# Altium schematic sheet TopSheet.SchDoc
size A4; Organization: UltraZohm; SheetNumber: 1; SheetTotal: 15
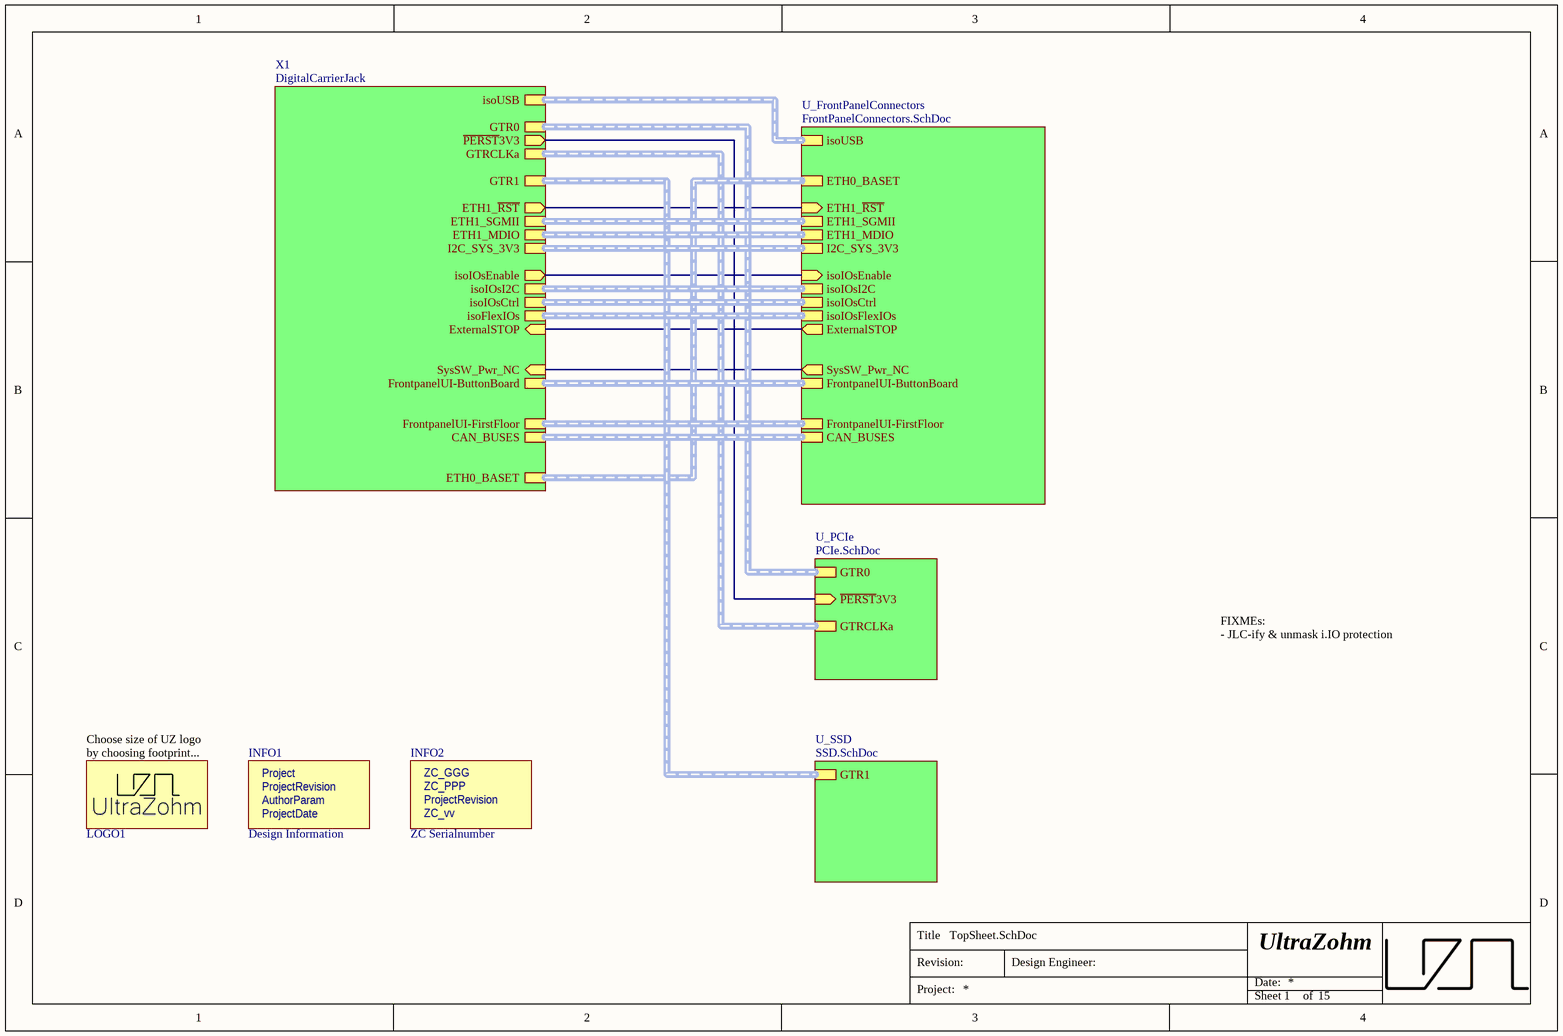
[diagram p0: TopSheet.SchDoc]

## Parts
INFO1  Design Information  [Design_info2]  (no BOM)
INFO2  ZC Serialnumber  [ZC-Serial]  (no BOM)
LOGO1  UZ Logo  [UZ_Logo_small]  (value not drawn)  (no BOM)

## Sub-sheets
U_FrontPanelConnectors = FrontPanelConnectors.SchDoc: isoUSB (harness USB), ETH0_BASET (harness ETH_BASET), ETH1_~{RST} (in), ETH1_SGMII (harness ETH_SGMII), ETH1_MDIO (harness ETH_MDIO), isoIOsEnable (in), isoIOsI2C (harness I2C), isoIOsCtrl (harness isoIOsCtrl), isoIOsFlexIOs (harness isoFlexIOs), ExternalSTOP (out), SysSW_Pwr_NC (out), FrontpanelUI-ButtonBoard (harness FrontpanelUI-ButtonBoard), FrontpanelUI-FirstFloor (harness FrontpanelUI-FirstFloor), CAN_BUSES (harness CAN_BUSES), I2C_SYS_3V3 (harness I2C)
U_PCIe = PCIe.SchDoc: GTR0 (harness GTR), ~{PERST}3V3 (in), GTRCLKa (harness MGTCLK)
U_SSD = SSD.SchDoc: GTR1 (harness GTR)
X1 = DigitalCarrierJack: isoUSB (harness USB), ETH0_BASET (harness ETH_BASET), ETH1_~{RST} (out), ETH1_SGMII (harness ETH_SGMII), ETH1_MDIO (harness ETH_MDIO), GTR0 (harness GTR), ~{PERST}3V3 (out), GTRCLKa (harness MGTCLK), GTR1 (harness GTR), isoIOsEnable (out), isoIOsI2C (harness I2C), isoIOsCtrl (harness isoIOsCtrl), isoFlexIOs (harness isoFlexIOs), ExternalSTOP (in), SysSW_Pwr_NC (in), FrontpanelUI-ButtonBoard (harness FrontpanelUI-ButtonBoard), FrontpanelUI-FirstFloor (harness FrontpanelUI-FirstFloor), CAN_BUSES (harness CAN_BUSES), I2C_SYS_3V3 (harness I2C)

## Nets
(unnamed): sheet X1/ETH1_~{RST}, sheet U_FrontPanelConnectors/ETH1_~{RST}
(unnamed): sheet X1/~{PERST}3V3, sheet U_PCIe/~{PERST}3V3
(unnamed): sheet X1/isoIOsEnable, sheet U_FrontPanelConnectors/isoIOsEnable
(unnamed): sheet X1/ExternalSTOP, sheet U_FrontPanelConnectors/ExternalSTOP
(unnamed): sheet X1/SysSW_Pwr_NC, sheet U_FrontPanelConnectors/SysSW_Pwr_NC

## Buses and harness runs
harness sheet U_FrontPanelConnectors/CAN_BUSES = sheet X1/CAN_BUSES
harness sheet U_FrontPanelConnectors/ETH0_BASET = sheet X1/ETH0_BASET
harness sheet U_FrontPanelConnectors/ETH1_MDIO = sheet X1/ETH1_MDIO
harness sheet U_FrontPanelConnectors/ETH1_SGMII = sheet X1/ETH1_SGMII
harness sheet U_FrontPanelConnectors/FrontpanelUI-ButtonBoard = sheet X1/FrontpanelUI-ButtonBoard
harness sheet U_FrontPanelConnectors/FrontpanelUI-FirstFloor = sheet X1/FrontpanelUI-FirstFloor
harness sheet U_FrontPanelConnectors/I2C_SYS_3V3 = sheet X1/I2C_SYS_3V3
harness sheet U_FrontPanelConnectors/isoIOsCtrl = sheet X1/isoIOsCtrl
harness sheet U_FrontPanelConnectors/isoIOsFlexIOs = sheet X1/isoFlexIOs
harness sheet U_FrontPanelConnectors/isoIOsI2C = sheet X1/isoIOsI2C
harness sheet U_FrontPanelConnectors/isoUSB = sheet X1/isoUSB
harness sheet U_PCIe/GTR0 = sheet X1/GTR0
harness sheet U_PCIe/GTRCLKa = sheet X1/GTRCLKa
harness sheet U_SSD/GTR1 = sheet X1/GTR1

## Notes on the sheet
- (near LOGO1) Choose size of UZ logo by choosing footprint...
- FIXMEs:
  - JLC-ify & unmask i.IO protection
- Title
- Revision:
- Design Engineer:
- Date:
- Project:
- Sheet
- of
- (in symbol Design Information) Project; ProjectRevision; AuthorParam; ProjectDate
- (in symbol ZC-Serial) ZC_GGG; ZC_PPP; ProjectRevision; ZC_vv

## Library data of the parts
INFO1 = Design Information: Manufacturer: UltraZohm; Created from: MGremer; Manufacturer Part Number: Design Information; PartID: 12; Created On: 03/11/2021 09:04:23; ComponentLink1Description: https://docs.ultrazohm.com/; ComponentLink1URL: homepage; Component Type: Design Information; Last Updated: 15/04/2025 09:29:36; Supplier 1: -; Supplier Part Number 1: -; Type: Design Information; Value: Design Information; Live Cycle Status: 1
INFO2 = ZC-Serial: Manufacturer: UltraZohm; Value: GGG-PPP-VVvv; Created from: FRosner; Manufacturer Part Number: ZC-Serial; PartID: 58; Created On: 15/04/2025 09:17:14; ComponentLink1Description: https://docs.ultrazohm.com/; ComponentLink1URL: homepage; Component Type: ZC Serialnumber; Last Updated: 15/04/2025 09:17:14; Supplier 1: -; Supplier Part Number 1: -; Type: Serial Number; Live Cycle Status: 1
LOGO1 = 1: Official Project Logo of the UltraZohm; Manufacturer: PCB Manufacturer; Manufacturer Part Number: UltraZohm Logo; Created from: T. Wendt; PartID: 1; Created On: 19.02.2021 16:55:56; ComponentLink1Description: Homepage; ComponentLink1URL: https://ultrazohm.com; Component Type: Logo; Last Updated: 02.03.2021 14:31:24; Type: Standard (No BOM); Live Cycle Status: 1